# EAGLE design LiDAR (EAGLE 9.6.2)
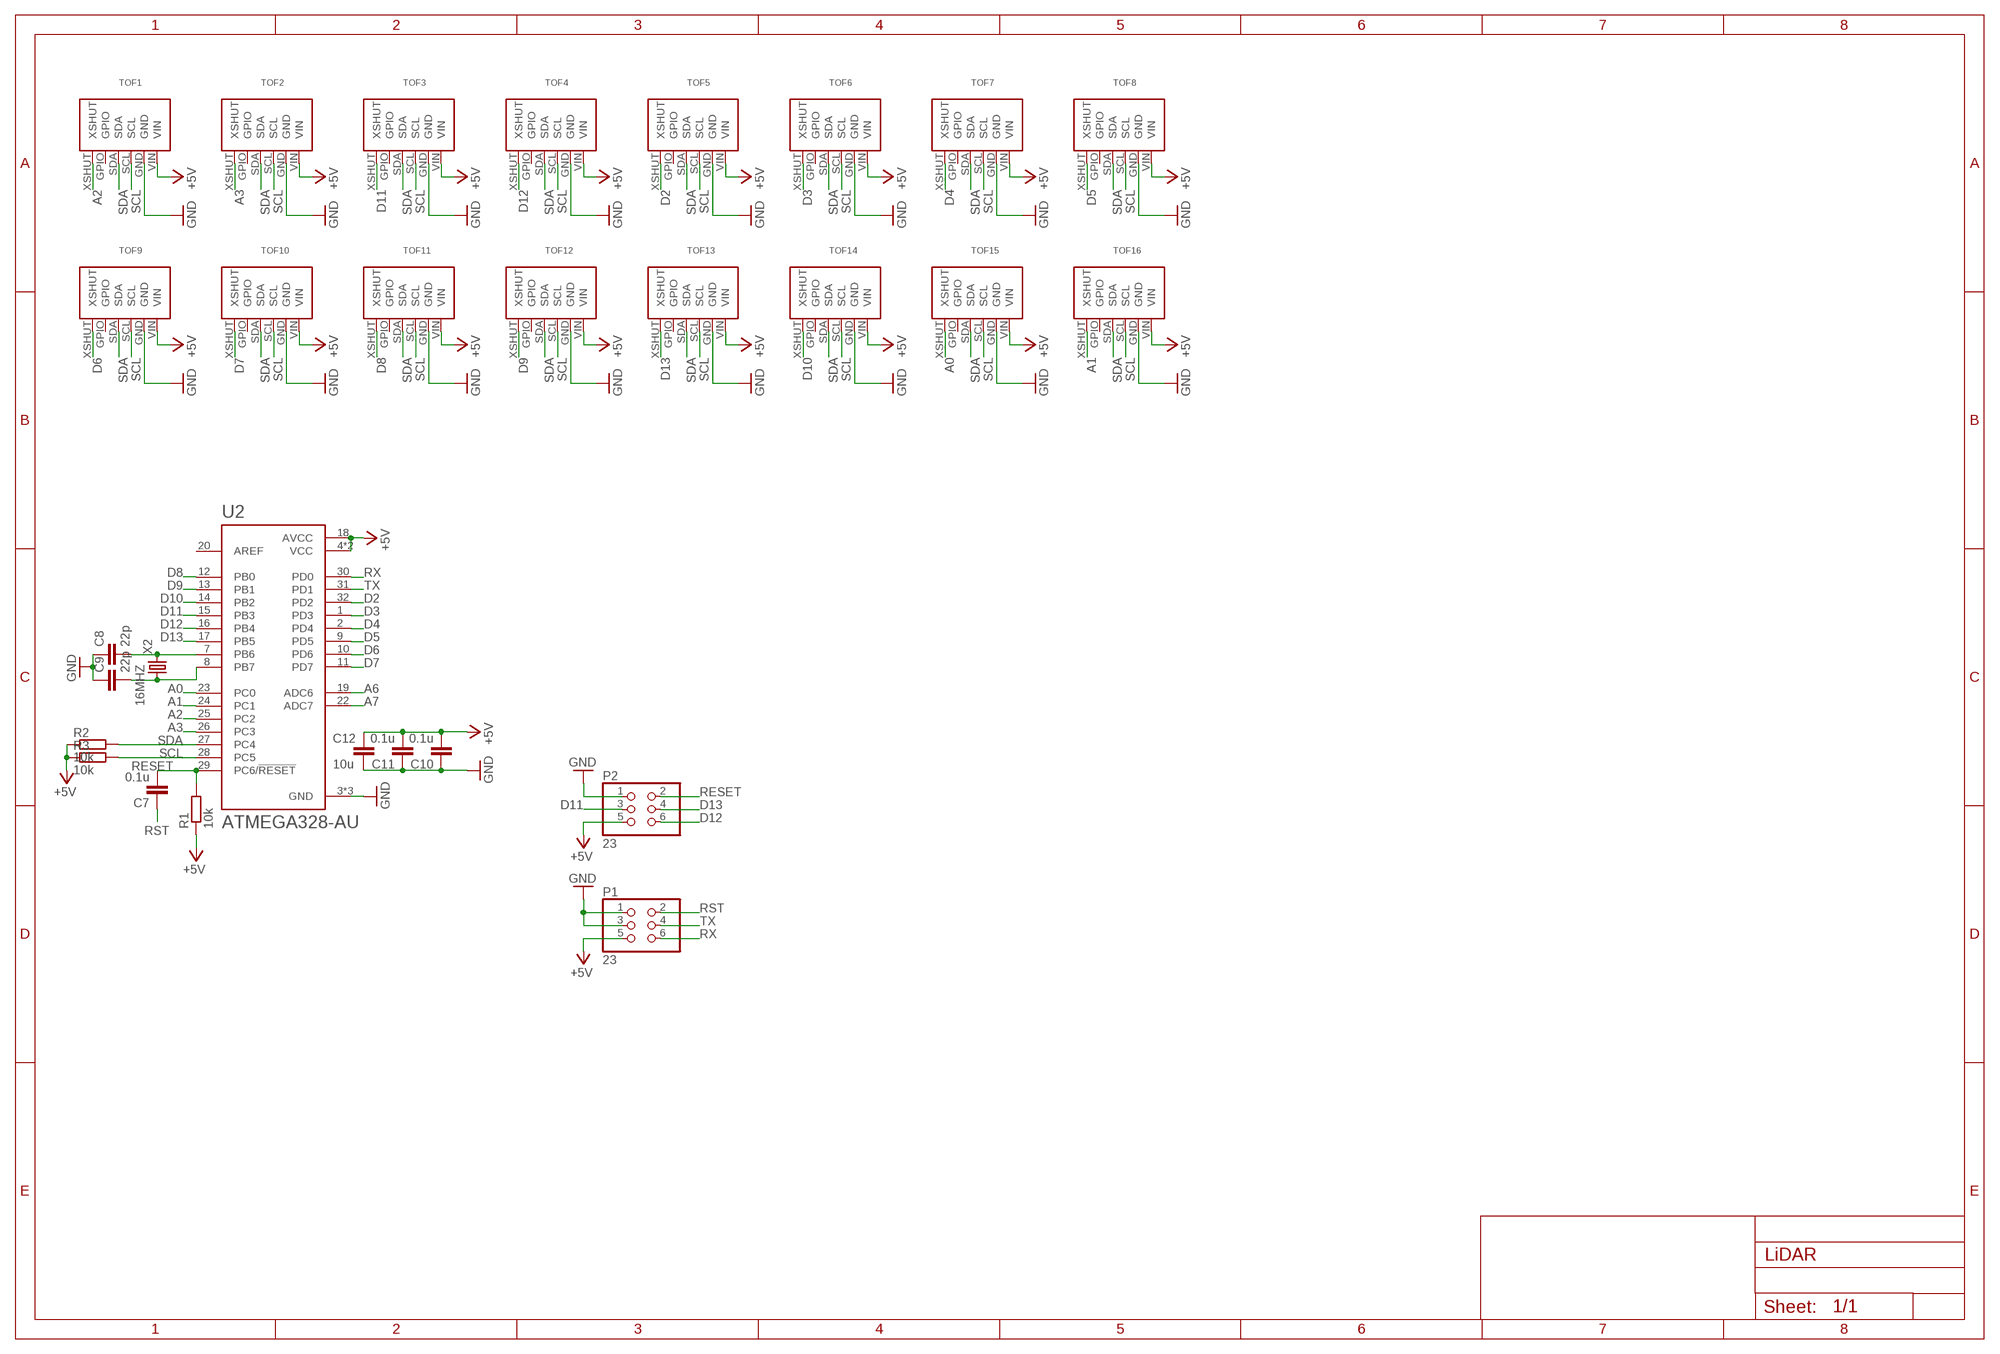
[diagram p0: schematic, sheet 1]

## Parts
C7  0.1u  C-EUC0603  [C0603]
C8  22p  C-EUC0603  [C0603]
C9  22p  C-EUC0603  [C0603]
C10  0.1u  C-EUC0603  [C0603]
C11  0.1u  C-EUC0603  [C0603]
C12  10u  C-EUC0805  [C0805]
P1  23  [2*3]
P2  23  [2*3]
R1  10k  R-EU_0204/7  [0204/7]
R2  10k  R-EU_0204/7  [0204/7]
R3  10k  R-EU_0204/7  [0204/7]
TOF1  VL53L0X  [VL53L0X]
TOF2  VL53L0X  [VL53L0X]
TOF3  VL53L0X  [VL53L0X]
TOF4  VL53L0X  [VL53L0X]
TOF5  VL53L0X  [VL53L0X]
TOF6  VL53L0X  [VL53L0X]
TOF7  VL53L0X  [VL53L0X]
TOF8  VL53L0X  [VL53L0X]
TOF9  VL53L0X  [VL53L0X]
TOF10  VL53L0X  [VL53L0X]
TOF11  VL53L0X  [VL53L0X]
TOF12  VL53L0X  [VL53L0X]
TOF13  VL53L0X  [VL53L0X]
TOF14  VL53L0X  [VL53L0X]
TOF15  VL53L0X  [VL53L0X]
TOF16  VL53L0X  [VL53L0X]
U2  ATMEGA328-AU  [QFP80P900X900X120-32N]
X2  16MHZ  [16MHZ]

## Nets
+5V: C10.2 C11.2 C12.1 P1.5 P2.5 R1.1 R2.1 R3.1 TOF1.VIN TOF2.VIN TOF3.VIN TOF4.VIN TOF5.VIN TOF6.VIN TOF7.VIN TOF8.VIN TOF9.VIN TOF10.VIN TOF11.VIN TOF12.VIN TOF13.VIN TOF14.VIN TOF15.VIN TOF16.VIN U2.4(VCC) U2.6(VCC) U2.18(AVCC)
A0: TOF15.XSHUT U2.23(PC0)
A1: TOF16.XSHUT U2.24(PC1)
A2: TOF1.XSHUT U2.25(PC2)
A3: TOF2.XSHUT U2.26(PC3)
A6: U2.19(ADC6)
A7: U2.22(ADC7)
D2: TOF5.XSHUT U2.32(PD2)
D3: TOF6.XSHUT U2.1(PD3)
D4: TOF7.XSHUT U2.2(PD4)
D5: TOF8.XSHUT U2.9(PD5)
D6: TOF9.XSHUT U2.10(PD6)
D7: TOF10.XSHUT U2.11(PD7)
D8: TOF11.XSHUT U2.12(PB0)
D9: TOF12.XSHUT U2.13(PB1)
D10: TOF14.XSHUT U2.14(PB2)
D11: P2.3 TOF3.XSHUT U2.15(PB3)
D12: P2.6 TOF4.XSHUT U2.16(PB4)
D13: P2.4 TOF13.XSHUT U2.17(PB5)
GND: C8.1 C9.1 C10.1 C11.1 C12.2 P1.1 P1.3 P2.1 TOF1.GND TOF2.GND TOF3.GND TOF4.GND TOF5.GND TOF6.GND TOF7.GND TOF8.GND TOF9.GND TOF10.GND TOF11.GND TOF12.GND TOF13.GND TOF14.GND TOF15.GND TOF16.GND U2.3(GND) U2.5(GND) U2.21(GND)
N$1: C8.2 U2.7(PB6) X2.P$2
N$2: C9.2 U2.8(PB7) X2.P$1
RESET: C7.2 P2.2 R1.2 U2.29(PC6/!RESET)
RST: C7.1 P1.2
RX: P1.6 U2.30(PD0)
SCL: R3.2 TOF1.SCL TOF2.SCL TOF3.SCL TOF4.SCL TOF5.SCL TOF6.SCL TOF7.SCL TOF8.SCL TOF9.SCL TOF10.SCL TOF11.SCL TOF12.SCL TOF13.SCL TOF14.SCL TOF15.SCL TOF16.SCL U2.28(PC5)
SDA: R2.2 TOF1.SDA TOF2.SDA TOF3.SDA TOF4.SDA TOF5.SDA TOF6.SDA TOF7.SDA TOF8.SDA TOF9.SDA TOF10.SDA TOF11.SDA TOF12.SDA TOF13.SDA TOF14.SDA TOF15.SDA TOF16.SDA U2.27(PC4)
TX: P1.4 U2.31(PD1)
Unconnected: TOF1.GPIO TOF2.GPIO TOF3.GPIO TOF4.GPIO TOF5.GPIO TOF6.GPIO TOF7.GPIO TOF8.GPIO TOF9.GPIO TOF10.GPIO TOF11.GPIO TOF12.GPIO TOF13.GPIO TOF14.GPIO TOF15.GPIO TOF16.GPIO U2.20(AREF)

## Library data of the parts
C7-C12 = rcl:C-EU: CAPACITOR, European symbol; SPICEPREFIX: C
P1 P2 = pin_socket:2*3
R1-R3 = rcl:R-EU_: RESISTOR, European symbol; SPICEPREFIX: R
TOF1-TOF16 = vl53l0x:VL53L0X
U2 = ATMEGA328-AU:ATMEGA328-AU: ATmega Series 20 MHz 32 KB Flash 2 KB SRAM 8-Bit Microcontroller - TQFP-32 Check availability <https://pricing.snapeda.com/parts/ATMEGA328-AU/Microchip/view-part?ref=eda>; AVAILABILITY: In Stock; DESCRIPTION: AVR AVR® ATmega Microcontroller IC 8-Bit 20MHz 32KB (16K x 16) FLASH 32-TQFP (7x7); MF: Microchip; MP: ATMEGA328-AU; PACKAGE: TQFP-32 Microchip; PRICE: None; PURCHASE-URL: https://pricing.snapeda.com/search/part/ATMEGA328-AU/?ref=eda
X2 = crystal:16MHZ

## Board
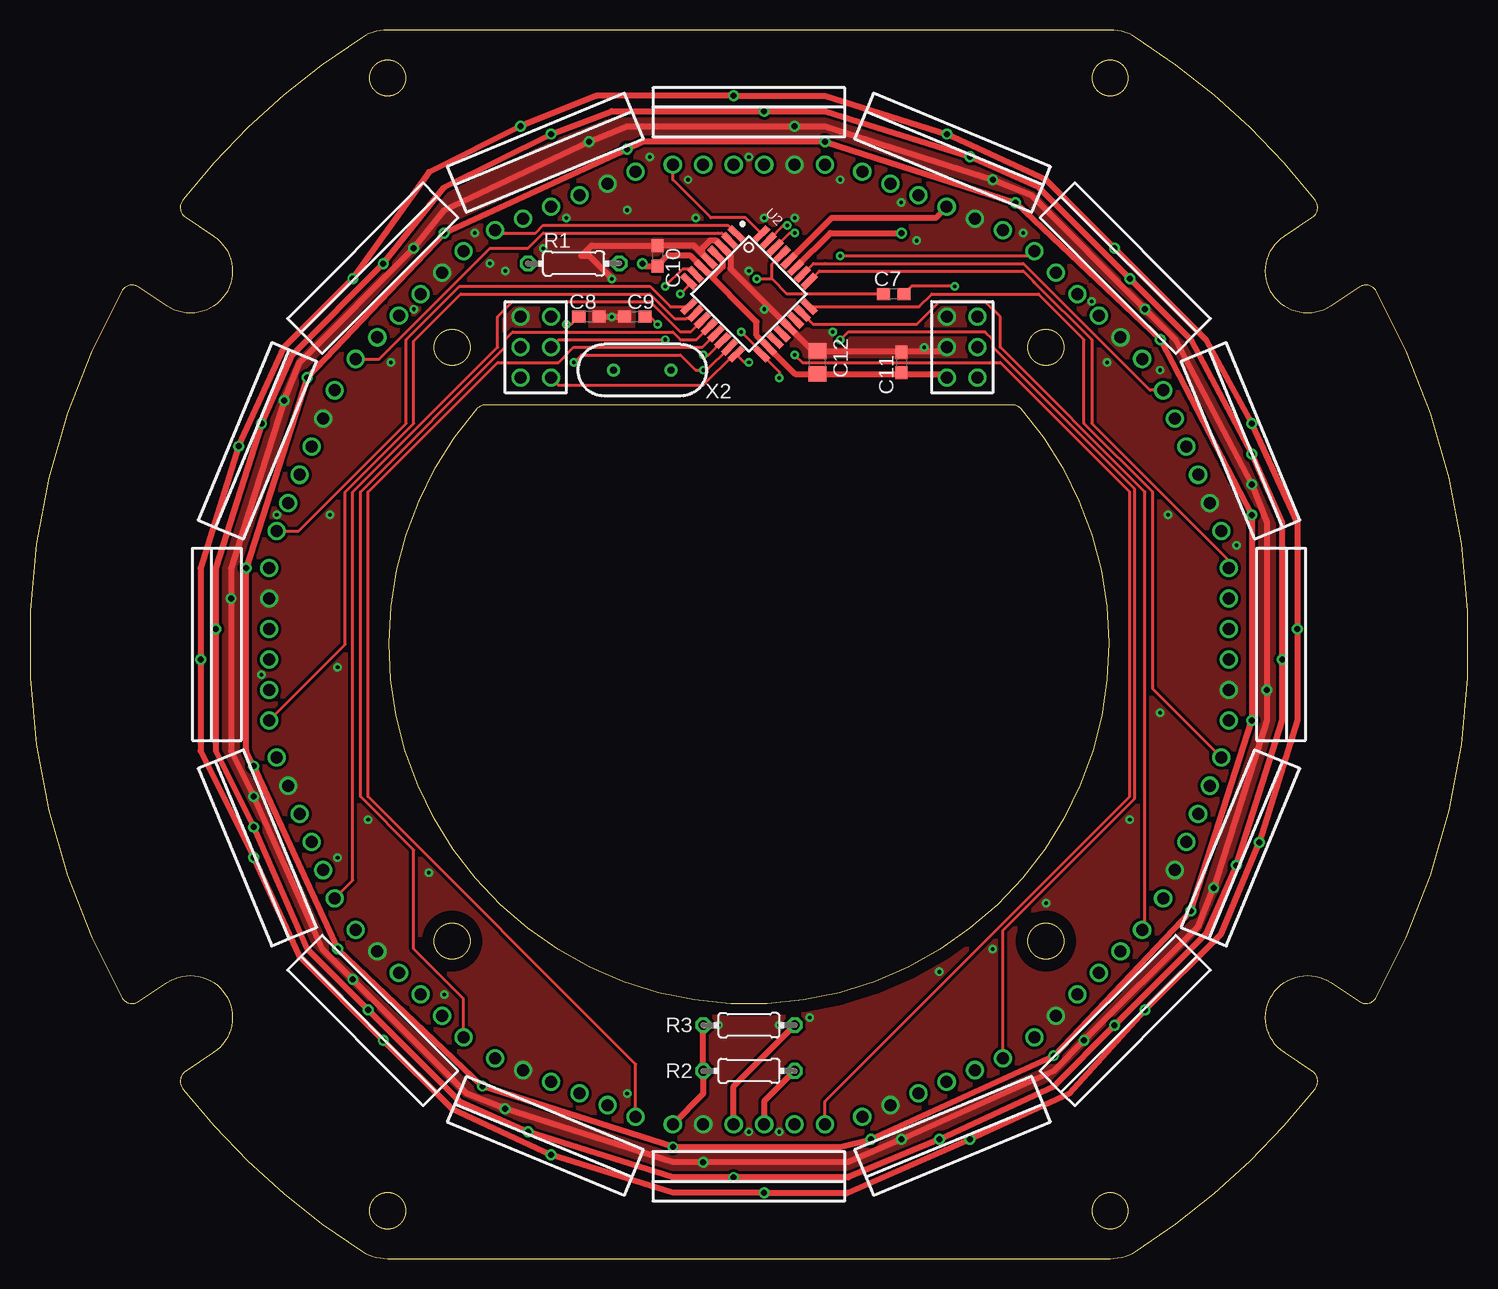
[diagram p1: board, top side]
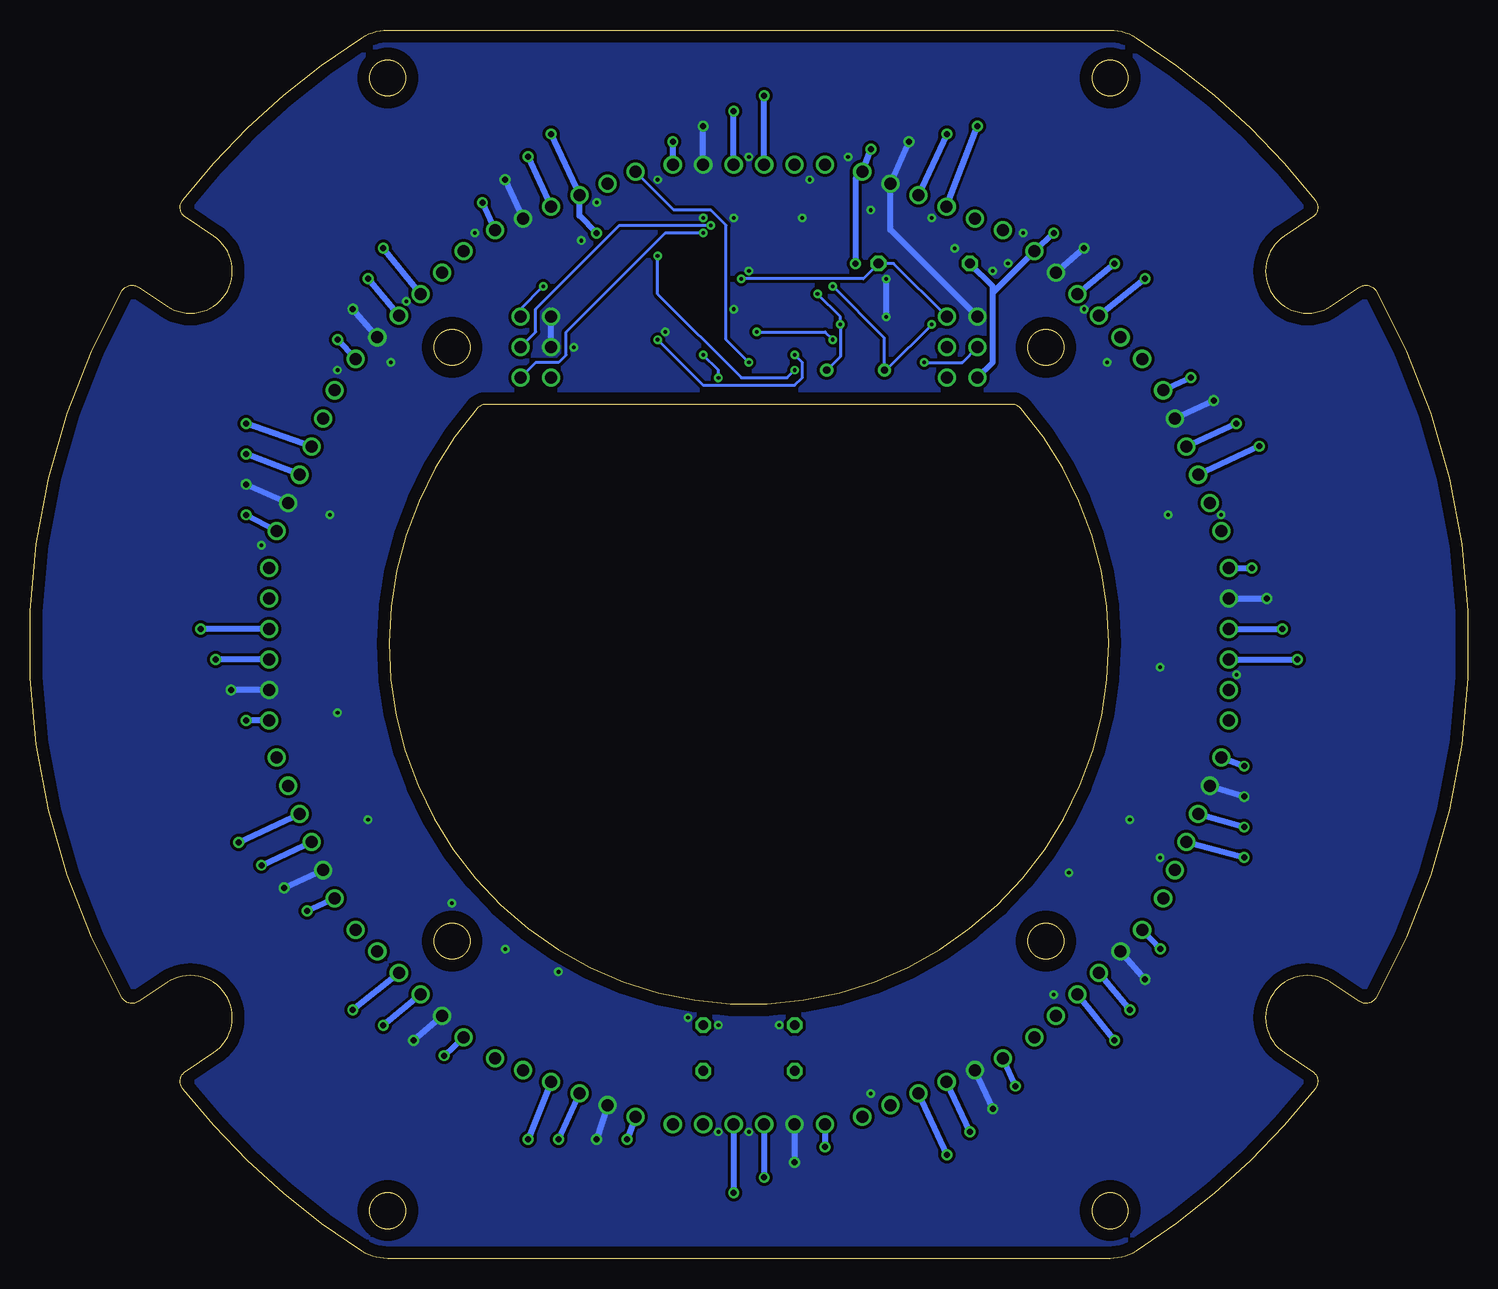
[diagram p2: board, bottom side, seen from below]

Size 119.87 x 102.43 mm. Coordinates in mm from the lower left corner, seen from the top.
Outline: 12.97,15.62 arc94 12.73,14.17 arc19 27.67,0.63 arc33 29.82,0 90.05,0 arc33 92.2,0.63 arc19 107.13,14.17 arc94 106.9,15.62 104.55,17.19 arc-180 108.44,23.01 110.79,21.44 arc94 112.22,21.78 arc59 112.22,80.65 arc94 110.79,80.99 108.44,79.42 arc-180 104.55,85.24 106.9,86.81 arc94 107.13,88.26 arc19 92.2,101.8 arc33 90.05,102.43 29.82,102.43 arc33 27.67,101.8 arc19 12.73,88.26 arc94 12.97,86.81 15.32,85.24 arc-180 11.43,79.42 9.08,80.99 arc94 7.65,80.65 arc59 7.65,21.78 arc94 9.08,21.44 11.43,23.01 arc-180 15.32,17.19 12.97,15.62
Outline: 38.03,71.21 81.84,71.21 arc-49 82.6,70.87 arc-262 37.27,70.87 arc-49 38.03,71.21
Outline: circle at 90.05,4 radius 1.5
Outline: circle at 90.05,98.43 radius 1.5
Outline: circle at 29.82,4 radius 1.5
Outline: circle at 29.82,98.43 radius 1.5
Outline: circle at 84.68,75.96 radius 1.5
Outline: circle at 35.19,75.96 radius 1.5
Outline: circle at 84.68,26.46 radius 1.5
Outline: circle at 35.19,26.46 radius 1.5
Copper layers (1*16): Top 0.035mm / dielectric 1.5mm / Bottom 0.035mm
Design rules "default *": minimum track width 6mil, minimum drill 0.3mm, track to track 6mil, track to pad 6mil, pad to pad 6mil, via to via 6mil, smd to smd 6mil, copper to edge 40mil, drill to drill 6mil, minimum pad ring 10mil, minimum via ring 8mil, stop-mask expansion 4mil, vias tented up to drill 0mil, thermal gap 10mil

### Footprints (pad centres in the part's own frame; a part is rotated, then mirrored left to right if it is on the bottom)
C0603 = smd 1.1 x 1: 1 -0.85,0; 2 0.85,0
C0805 = smd 1.3 x 1.5: 1 -0.95,0; 2 0.95,0
2*3 = drill 1: 1 -1.27,2.54; 2 1.27,2.54; 3 -1.27,0; 4 1.27,0; 5 -1.27,-2.54; 6 1.27,-2.54
0204/7 = drill 0.813 octagon: 1 -3.81,0; 2 3.81,0
VL53L0X = drill 1: GND 3.81,0; GPIO -3.81,0; SCL 1.27,0; SDA -1.27,0; VIN 6.35,0; XSHUT -6.35,0
QFP80P900X900X120-32N = smd 1.5 x 0.55: 1 -4.3,2.8; 2 -4.3,2; 3 -4.3,1.2; 4 -4.3,0.4; 5 -4.3,-0.4; 6 -4.3,-1.2; 7 -4.3,-2; 8 -4.3,-2.8; 17 4.3,-2.8; 18 4.3,-2; 19 4.3,-1.2; 20 4.3,-0.4; 21 4.3,0.4; 22 4.3,1.2; 23 4.3,2; 24 4.3,2.8 | smd 0.55 x 1.5: 9 -2.8,-4.3; 10 -2,-4.3; 11 -1.2,-4.3; 12 -0.4,-4.3; 13 0.4,-4.3; 14 1.2,-4.3; 15 2,-4.3; 16 2.8,-4.3; 25 2.8,4.3; 26 2,4.3; 27 1.2,4.3; 28 0.4,4.3; 29 -0.4,4.3; 30 -1.2,4.3; 31 -2,4.3; 32 -2.8,4.3
16MHZ = drill 0.6: P$1 -2.4,0; P$2 2.4,0

### Placement (x,y rotation side)
C7  72,80.42 180 top
C8  46.6,78.52 180 top
C9  50.41,78.52 0 top
C10  52.31,83.6 270 top
C11  72.63,74.71 270 top
C12  65.65,74.71 90 top
P1  77.71,75.98 0 top
P2  42.15,75.98 0 top
R1  45.33,82.96 0 top
R2  59.93,15.65 0 top
R3  59.93,19.46 0 top
TOF1  99.93,51.21 270 top
TOF2  96.89,66.52 292.5 top
TOF3  88.22,79.5 315 top
TOF4  75.24,88.17 337.5 top
TOF5  59.93,91.21 0 top
TOF6  44.63,88.17 22.5 top
TOF7  31.65,79.5 45 top
TOF8  22.98,66.52 67.5 top
TOF9  19.93,51.21 90 top
TOF10  22.98,35.91 112.5 top
TOF11  31.65,22.93 135 top
TOF12  44.63,14.26 157.5 top
TOF13  59.93,11.21 180 top
TOF14  75.24,14.26 202.5 top
TOF15  88.22,22.93 225 top
TOF16  96.89,35.91 247.5 top
U2  59.93,80.42 315 top
X2  51.04,74.07 180 top

### Tracks (layer width: path | path; a pad name or v marks a point on that pad's centre or on a via)
+5V  (via drill 0.5)
  Top 0.25: 56.48,82.18 U2.6
  Top 0.5: 56.48,82.18 56.61,82.05 57.11,82.05 57.74,82.68 57.74,83.19 U2.4 | 72.63,73.76 C12.1 63.77,73.76 U2.18 60.57,76.96 60.57,78.09 U2.6 55.06,83.6 53.16,83.6 C10.2 51.26,82.75 v51.04,82.96 | 72.63,73.76 76.12,73.76 P1.5 | C11.2 72.63,73.76 | TOF13.VIN 56.12,13.75 R2.1 R3.1 | v66.28,93.12 v82.16,88.04 v94.22,76.61 v101.84,62.01 v101.84,44.86 v96.76,28.99 v85.33,16.92 v70.09,9.94 67.55,9.3 v53.58,9.3 v37.71,14.38 v25.64,25.81 v18.66,41.05 18.02,42.32 v18.02,57.56 v23.1,73.44 v34.53,85.5 v49.77,92.49 51.04,93.12 v66.28,93.12
  Bottom 0.25: 39.61,80.51 39.61,80.42
  Bottom 0.5: TOF5.VIN v66.28,93.12 | TOF4.VIN v82.16,88.04 | TOF3.VIN v94.22,76.61 | TOF2.VIN v101.84,62.01 | TOF1.VIN v101.84,44.86 | TOF16.VIN v96.76,28.99 | TOF15.VIN v85.33,16.92 | TOF14.VIN v70.09,9.94 | TOF13.VIN v53.58,9.3 | TOF12.VIN v37.71,14.38 | TOF11.VIN v25.64,25.81 | TOF10.VIN v18.66,41.05 | TOF9.VIN v18.02,57.56 | TOF8.VIN v23.1,73.44 | v34.53,85.5 TOF7.VIN 39.61,80.51 | v49.77,92.49 TOF6.VIN 51.04,90.05 v51.04,82.96 | P2.5 39.61,74.71 39.61,80.42 39.61,81.06 R1.1
A0
  Top 0.25: TOF15.XSHUT 92.95,27.66 92.95,63.91 80.89,75.98 80.89,78.52 79.62,79.79 75.81,79.79 73.9,77.88 65.3,77.88 U2.23
A1
  Top 0.25: TOF16.XSHUT 93.59,47.5 93.59,63.91 87.87,69.63 87.87,76.61 84.06,80.42 75.17,80.42 74.11,79.36 U2.24
A2
  Top 0.25: TOF1.XSHUT 99.93,58.2 88.51,69.63 88.51,76.61 83.75,81.38 83.64,81.48 82.79,82.33 65.8,82.33 U2.25
A3
  Top 0.25: TOF2.XSHUT 93.37,72.39 84.06,81.69 82.79,82.96 66.28,82.96 65.3,82.96 U2.26
D2
  Top 0.25: U2.32 59.67,86.77 56.75,86.77 53.58,89.94 TOF5.XSHUT
D3
  Top 0.25: TOF6.XSHUT 39,85.5 42.15,85.5 42.79,86.14 58.18,86.14 U2.1
D4
  Top 0.25: TOF7.XSHUT 29.12,75.01 38.34,84.23 41.52,84.23 42.79,85.5 57.39,85.5 57.68,85.5 | 57.68,85.5 | 57.68,85.5 U2.2
D5
  Top 0.25: TOF8.XSHUT 22.39,60.65 31.36,69.63 31.36,76.61 35.8,81.06 51.68,81.06 53.38,79.36 U2.9
D6
  Top 0.25: TOF9.XSHUT 26.28,51.21 26.28,63.91 31.99,69.63 31.99,76.51 35.91,80.42 51.68,80.42 53.74,78.36 54.69,78.36 55.04,78.36 | U2.10 55.04,78.36 | 55.04,78.36
D7
  Top 0.25: TOF10.XSHUT 26.91,31.54 26.91,63.91 38.98,75.98 38.98,78.52 40.25,79.79 51.68,79.79 54.22,77.25 55.06,77.25 U2.11
D8
  Top 0.25: TOF11.XSHUT 36.14,21.67 31.99,25.81 31.99,34.07 27.55,38.51 27.55,63.91 39.61,75.98 39.61,76.61 40.25,77.25 53.58,77.25 54.22,76.61 55.56,76.61 U2.12
D9
  Top 0.25: TOF12.XSHUT 50.49,16.2 28.18,38.51 28.18,63.91 38.98,74.71 44.06,74.71 45.33,75.98 56.06,75.98 U2.13
D10  (via drill 0.3)
  Top 0.25: TOF14.XSHUT 81.11,27.37 92.09,38.35 92.09,64.15 80.25,75.98 80.25,76.61 79.62,77.25 68.19,77.25 v67.55,76.61 | v56.12,75.34 56.55,75.34 U2.14
  Bottom 0.25: v67.55,76.61 63.74,72.8 56.12,72.8 55.49,73.44 55.49,74.71 v56.12,75.34
D11  (via drill 0.3)
  Top 0.25: v45.33,74.71 45.96,75.34 54.22,75.34 55.49,74.07 v56.12,74.07 56.41,74.07 U2.15 | TOF3.XSHUT 83.34,83.6 v67.55,83.6
  Bottom 0.25: v45.33,74.71 42.15,74.71 P2.3 | v67.55,83.6 67.55,80.42 60.57,73.44 56.76,73.44 v56.12,74.07
D12  (via drill 0.3)
  Top 0.25: P2.6 44.06,72.8 56.12,72.8 58.72,75.4 U2.16 59.57,74.71 v59.93,74.71
  Bottom 0.25: v59.93,74.71 61.84,76.61 61.84,86.14 63.11,87.41 66.18,87.41 TOF4.XSHUT
D13  (via drill 0.3)
  Top 0.25: P2.4 44.06,76.61 v52.95,76.61 | v59.3,77.25 61,75.55 U2.17 62.47,73.92 v62.47,73.44 | TOF13.XSHUT 66.28,13.11 91.68,38.51 91.68,63.91 80.89,74.71 64.38,74.71 v63.74,75.34
  Bottom 0.25: v59.3,77.25 53.58,77.25 v52.95,76.61 | v62.47,73.44 62.47,74.07 v63.74,75.34
GND  (via drill 0.3, 0.5)
  Top 0.5: 98.73,31.08 103.11,44.86 v103.11,47.4 103.11,61.37 v101.84,64.55 95.49,76.61 v92.95,79.15 83.43,88.68 v80.25,89.95 66.28,94.39 v63.74,94.39 49.77,94.39 v46.6,93.12 34.53,87.41 v31.99,84.23 22.47,74.71 v21.2,71.53 16.75,57.56 v16.75,55.02 16.75,42.32 v18.66,38.51 24.37,25.81 v26.91,23.27 36.44,13.75 v39.61,12.48 53.58,8.03 v56.12,8.03 68.19,8.03 v72.63,9.94 85.33,15.65 v87.87,18.19 97.4,27.72 98.73,31.08 | 98.73,31.08 v98.67,30.89 | 72.63,75.66 C12.2 65.27,75.66 U2.21 58.39,82.53 58.39,83.66 U2.3 57.18,84.87 56.67,84.87 56.05,84.25 56.05,83.74 U2.5 55.34,84.45 C10.1 46.81,84.45 45.96,83.6 46.6,83.6 v48.5,81.69 | 72.63,75.66 76.12,75.66 P1.3 | C8.1 v48.5,78.52 C9.1 | C11.1 72.63,75.66
  Bottom 0.5: TOF5.GND v63.74,94.39 | TOF4.GND v80.25,89.95 | TOF3.GND v92.95,79.15 | TOF2.GND v101.84,64.55 | TOF1.GND v103.11,47.4 | TOF16.GND v98.67,30.89 | TOF15.GND v87.87,18.19 | TOF14.GND v72.63,9.94 | TOF13.GND v56.12,8.03 | TOF12.GND v39.61,12.48 | TOF11.GND v26.91,23.27 | TOF10.GND v18.66,38.51 | TOF9.GND v16.75,55.02 | TOF8.GND v21.2,71.53 | TOF7.GND v31.99,84.23 | v46.6,93.12 TOF6.GND 48.15,85.78 45.96,83.6 P2.1 | P1.3 P1.1 | v48.5,81.69 v48.5,78.52
  other vias: 39.61,82.33 37.07,85.5 31.99,79.15 30.09,74.71 20.56,62.01 25.01,62.01 19.29,48.67 25.64,49.31 25.64,33.43 28.18,36.61 34.53,22 33.26,32.16 49.77,13.75 75.81,23.91 80.25,25.81 91.68,36.61 84.7,29.62 94.22,45.5 94.86,62.01 100.57,59.47 89.78,74.71 94.22,74.07 88.51,79.79 82.79,85.5 73.9,84.87 72.63,88.04 63.74,86.77 54.85,89.95 67.55,89.95 49.77,87.41 51.68,91.85 38.34,82.96 61.2,79.15 74.54,75.98 55.49,86.77 61.2,86.77 59.93,91.85 66.92,77.25 44.69,86.77 59.93,82.33 42.79,84.23 62.47,19.46 57.39,19.46 59.93,10.57 62.47,10.57 65.01,20.1
  pour Top (isolate 0.25, no thermals): -11.19,107.09 123.43,107.09 123.43,-7.21 -11.19,-7.21 -11.19,105.82
  pour Bottom (isolate 0.25, no thermals): -9.92,108.36 -9.92,-4.67 125.97,-4.67 125.97,108.36
N$1  (via drill 0.3)
  Top 0.25: C8.2 45.11,77.88 v44.69,77.88 | v52.95,81.06 54.38,82.49 55.04,82.49 U2.7
  Bottom 0.25: v44.69,77.88 48.5,74.07 X2.P$2 48.64,76.75 v52.95,81.06
N$2  (via drill 0.3)
  Top 0.25: C9.2 51.68,78.52 v52.31,77.88 | v54.22,80.42 54.91,81.12 U2.8
  Bottom 0.25: X2.P$1 52.31,75.2 v52.31,77.88 52.31,78.52 v54.22,80.42
RESET  (via drill 0.3)
  Top 0.25: C7.2 63.11,80.42 61.84,81.69 | 61.84,81.69 61.84,82.89 U2.29 | v60.57,81.69 61.84,81.69
  Bottom 0.25: P2.2 47.87,82.96 R1.2 50.41,81.69 v60.57,81.69
RST  (via drill 0.3)
  Top 0.25: v77.08,81.06 73.48,81.06 C7.1
  Bottom 0.25: P1.2 78.98,79.15 v77.08,81.06
RX  (via drill 0.3)
  Top 0.25: U2.30 63.32,85.5 v63.74,85.5
  Bottom 0.25: v63.74,85.5 66.92,85.5 75.17,77.25 75.17,75.34 75.81,74.71 77.71,74.71 P1.6
SCL  (via drill 0.5)
  Top 0.5: U2.28 66.85,86.77 75.51,86.77 TOF4.SCL | TOF13.SCL 58.66,14.38 R3.2 | v61.2,95.66 66.28,95.66 v78.35,91.85 84.06,89.31 v91.68,81.69 96.76,76.61 v101.84,67.09 104.38,61.37 v104.38,49.94 104.38,44.86 v100.57,32.8 98.03,27.08 v90.41,19.46 85.33,14.38 v75.81,9.94 68.19,6.76 v58.66,6.76 53.58,6.76 v41.52,10.57 35.8,13.11 v28.18,20.73 23.1,25.81 v18.66,35.97 15.48,42.32 v15.48,52.48 15.48,57.56 v19.29,69.63 21.83,75.34 v29.45,82.96 34.53,89.31 v43.42,93.76 48.5,95.66 v61.2,95.66
  Bottom 0.5: TOF5.SCL v61.2,95.66 | TOF4.SCL v78.35,91.85 | TOF3.SCL v91.68,81.69 | TOF2.SCL v101.84,67.09 | TOF1.SCL v104.38,49.94 | TOF16.SCL v100.57,32.8 | TOF15.SCL v90.41,19.46 | TOF14.SCL v75.81,9.94 | TOF13.SCL v58.66,6.76 | TOF12.SCL v41.52,10.57 | TOF11.SCL v28.18,20.73 | TOF10.SCL v18.66,35.97 | TOF9.SCL v15.48,52.48 | TOF8.SCL v19.29,69.63 | TOF7.SCL v29.45,82.96 | TOF6.SCL v43.42,93.76
SDA  (via drill 0.5)
  Top 0.5: U2.27 66.71,85.5 v72.63,85.5 | R2.2 61.2,13.11 TOF13.SDA | v58.66,96.93 66.28,96.93 v76.44,93.76 84.7,89.95 v90.41,84.23 98.03,76.61 v101.84,69.63 105.65,61.37 v105.65,52.48 105.65,44.86 v102.48,34.7 99.3,27.08 v92.95,20.73 86.6,13.75 v78.35,9.94 68.19,5.49 v61.2,5.49 53.58,5.49 v43.42,8.67 35.17,12.48 v29.45,18.19 22.47,25.18 v18.66,33.43 14.21,42.32 v14.21,49.94 14.21,57.56 v17.39,67.72 21.2,75.98 v26.91,81.69 33.26,90.58 v40.88,94.39 47.23,96.93 v58.66,96.93
  Bottom 0.5: TOF5.SDA v58.66,96.93 | v76.44,93.76 TOF4.SDA 74.07,86.94 v72.63,85.5 | TOF3.SDA v90.41,84.23 | TOF2.SDA v101.84,69.63 | TOF1.SDA v105.65,52.48 | TOF16.SDA v102.48,34.7 | TOF15.SDA v92.95,20.73 | TOF14.SDA v78.35,9.94 | TOF13.SDA v61.2,5.49 | TOF12.SDA v43.42,8.67 | TOF11.SDA v29.45,18.19 | TOF10.SDA v18.66,33.43 | TOF9.SDA v14.21,49.94 | TOF8.SDA v17.39,67.72 | TOF7.SDA v26.91,81.69 | TOF6.SDA v40.88,94.39
TX  (via drill 0.3)
  Top 0.25: v63.11,86.14 62.82,86.14 U2.31
  Bottom 0.25: P1.4 77.71,77.25 77.71,79.15 70.73,86.14 v63.11,86.14